# Altium schematic sheet Main_1.SchDoc
size 299 x 299 mm; SheetNumber: 4; SheetTotal: 12
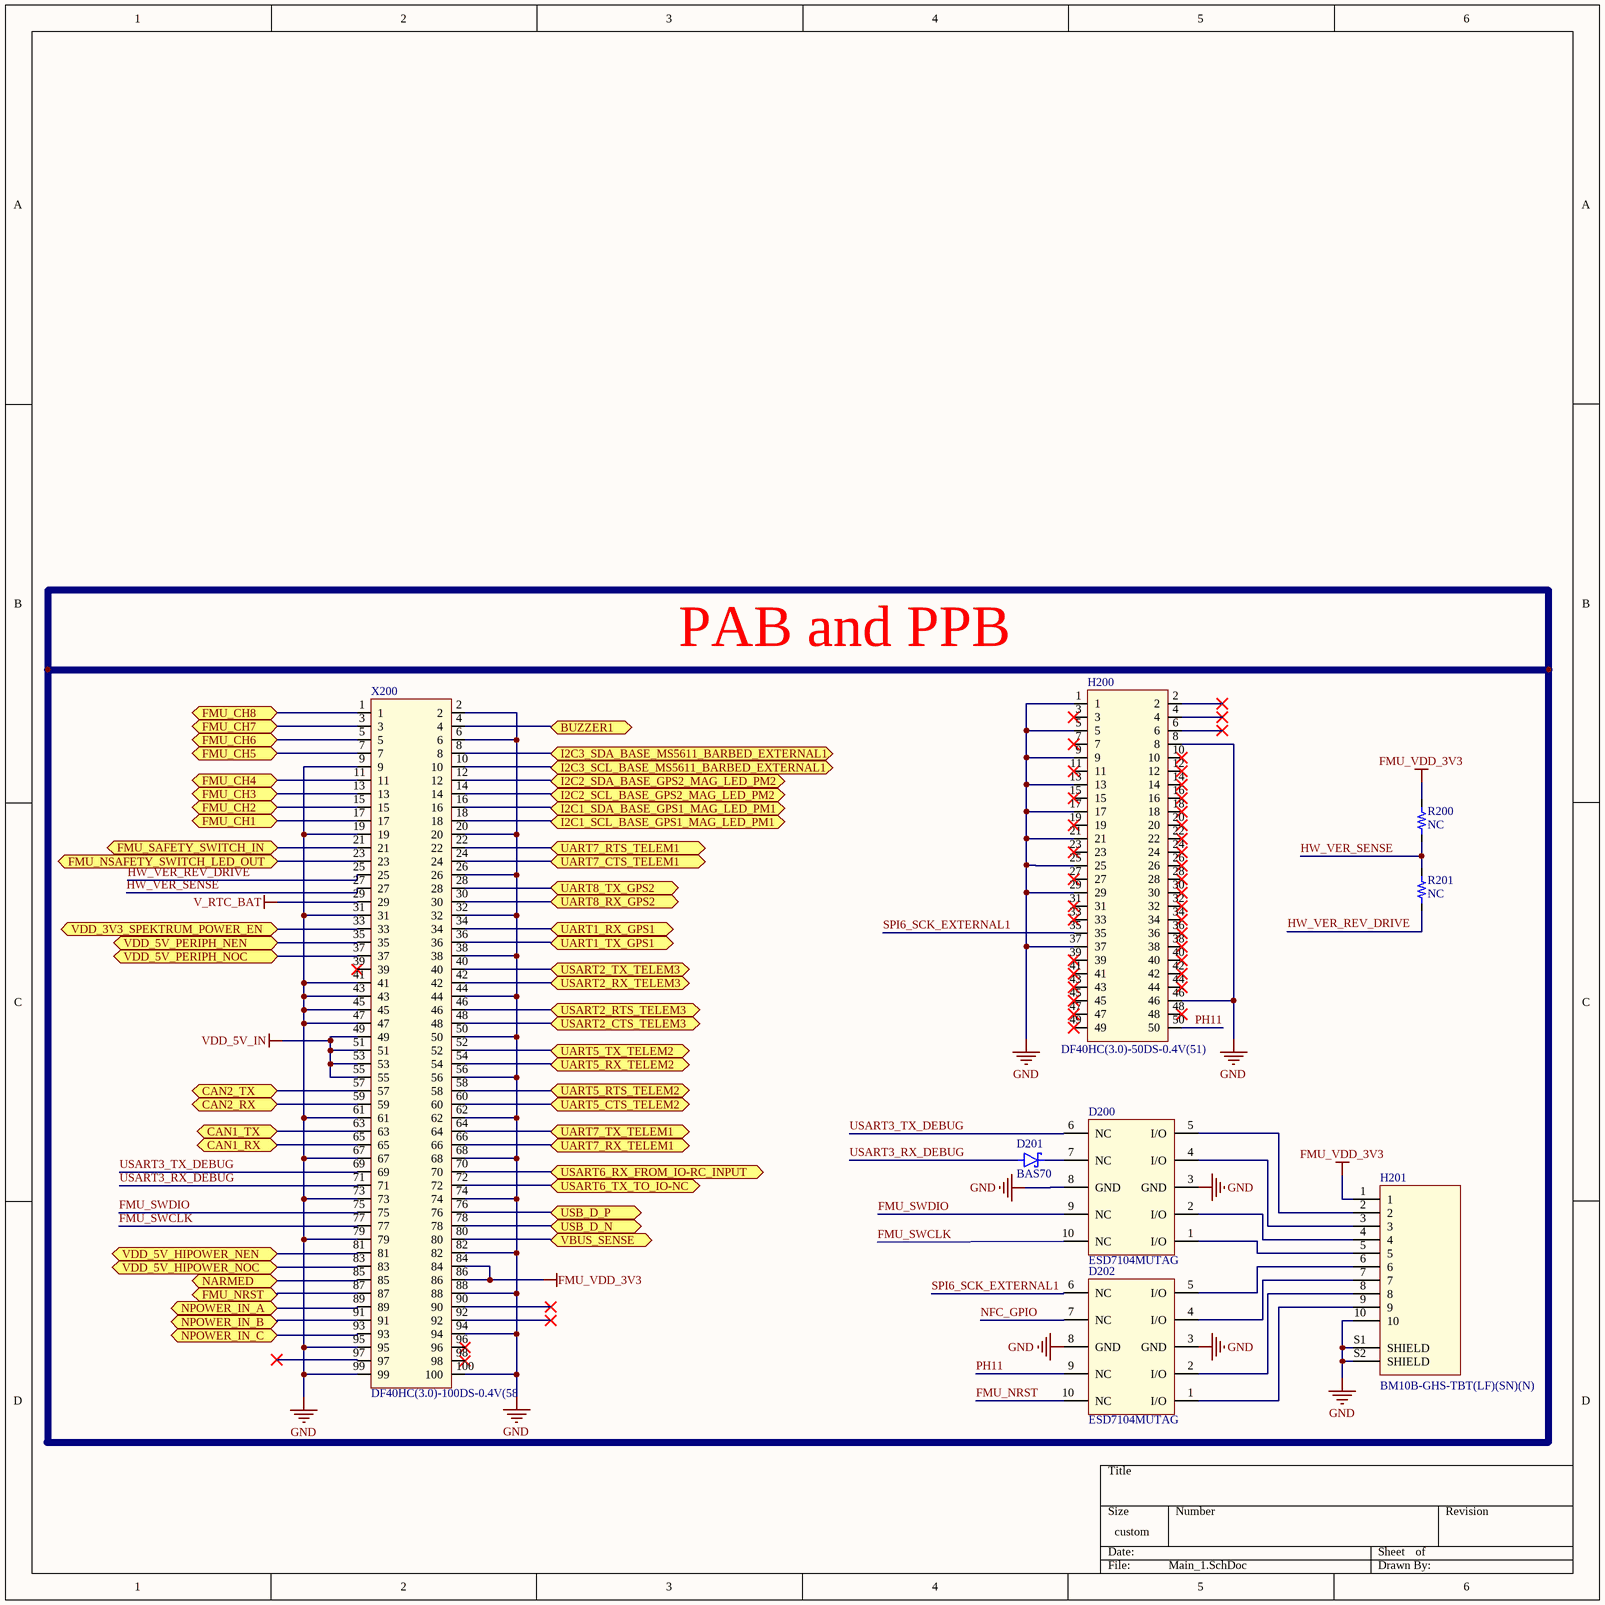
[diagram p0: Main_1.SchDoc]

## Parts
D200  ESD7104MUTAG  [UDFN10 2.5x1, 0.5P]
D201  BAS70  [SOT-23-3]
D202  ESD7104MUTAG  [UDFN10 2.5x1, 0.5P]
H200  DF40HC(3.0)-50DS-0.4V(51)  [DF40HC(4.0)-50DS-0.4V(51)]
H201  BM10B-GHS-TBT(LF)(SN)(N)  [BM10B-GHS-TBT(LF)(SN)(N)]
R200  NC  [R0603]
R201  NC  [R0603]
X200  DF40HC(3.0)-100DS-0.4V(58  [DF40HC(3.0)-100DS-0.4V(58]

## Ports
BUZZER1 (bidir), CAN1_RX (bidir), CAN1_TX (bidir), CAN2_RX (bidir), CAN2_TX (bidir), FMU_CH1 (bidir), FMU_CH2 (bidir), FMU_CH3 (bidir), FMU_CH4 (bidir), FMU_CH5 (bidir), FMU_CH6 (bidir), FMU_CH7 (bidir), FMU_CH8 (bidir), FMU_NRST (bidir), FMU_NSAFETY_SWITCH_LED_OUT (bidir), FMU_SAFETY_SWITCH_IN (bidir), I2C1_SCL_BASE_GPS1_MAG_LED_PM1 (bidir), I2C1_SDA_BASE_GPS1_MAG_LED_PM1 (bidir), I2C2_SCL_BASE_GPS2_MAG_LED_PM2 (bidir), I2C2_SDA_BASE_GPS2_MAG_LED_PM2 (bidir), I2C3_SCL_BASE_MS5611_BARBED_EXTERNAL1 (bidir), I2C3_SDA_BASE_MS5611_BARBED_EXTERNAL1 (bidir), NARMED (bidir), NPOWER_IN_A (bidir), NPOWER_IN_B (bidir), NPOWER_IN_C (bidir), UART1_RX_GPS1 (bidir), UART1_TX_GPS1 (bidir), UART5_CTS_TELEM2 (bidir), UART5_RTS_TELEM2 (bidir), UART5_RX_TELEM2 (bidir), UART5_TX_TELEM2 (bidir), UART7_CTS_TELEM1 (bidir), UART7_RTS_TELEM1 (bidir), UART7_RX_TELEM1 (bidir), UART7_TX_TELEM1 (bidir), UART8_RX_GPS2 (bidir), UART8_TX_GPS2 (bidir), USART2_CTS_TELEM3 (bidir), USART2_RTS_TELEM3 (bidir), USART2_RX_TELEM3 (bidir), USART2_TX_TELEM3 (bidir), USART6_RX_FROM_IO-RC_INPUT (bidir), USART6_TX_TO_IO-NC (bidir), USB_D_N (bidir), USB_D_P (bidir), VBUS_SENSE (bidir), VDD_3V3_SPEKTRUM_POWER_EN (bidir), VDD_5V_HIPOWER_NEN (bidir), VDD_5V_HIPOWER_NOC (bidir), VDD_5V_PERIPH_NEN (bidir), VDD_5V_PERIPH_NOC (bidir)

## Nets
FMU_VDD_3V3: H201.1 R200.2 X200.84 X200.86
GND: D200.3(GND) D200.8(GND) D202.3(GND) D202.8(GND) H200.1 H200.5 H200.8 H200.9 H200.13 H200.17 H200.21 H200.25 H200.29 H200.37 H200.46 H201.10 H201.S1(SHIELD) H201.S2(SHIELD) X200.2 X200.6 X200.9 X200.19 X200.20 X200.26 X200.31 X200.32 X200.38 X200.41 X200.43 X200.44 X200.45 X200.47 X200.50 X200.56 X200.61 X200.62 X200.67 X200.68 X200.73 X200.74 X200.79 X200.82 X200.88 X200.94 X200.95 X200.99 X200.100
V_RTC_BAT: X200.29
VDD_5V_IN: X200.49 X200.51 X200.53 X200.55
BUZZER1: X200.4 ; port BUZZER1
CAN1_RX: X200.65 ; port CAN1_RX
CAN1_TX: X200.63 ; port CAN1_TX
CAN2_RX: X200.59 ; port CAN2_RX
CAN2_TX: X200.57 ; port CAN2_TX
FMU_CH1: X200.17 ; port FMU_CH1
FMU_CH2: X200.15 ; port FMU_CH2
FMU_CH3: X200.13 ; port FMU_CH3
FMU_CH4: X200.11 ; port FMU_CH4
FMU_CH5: X200.7 ; port FMU_CH5
FMU_CH6: X200.5 ; port FMU_CH6
FMU_CH7: X200.3 ; port FMU_CH7
FMU_CH8: X200.1 ; port FMU_CH8
FMU_NRST: D202.10(NC)
FMU_NRST: X200.87 ; port FMU_NRST  [a separate net that carries the same name]
FMU_NSAFETY_SWITCH_LED_OUT: X200.23 ; port FMU_NSAFETY_SWITCH_LED_OUT
FMU_SAFETY_SWITCH_IN: X200.21 ; port FMU_SAFETY_SWITCH_IN
FMU_SWCLK: D200.10(NC) X200.77
FMU_SWDIO: D200.9(NC) X200.75
HW_VER_REV_DRIVE: R201.1 X200.25
HW_VER_SENSE: R200.1 R201.2 X200.27
I2C1_SCL_BASE_GPS1_MAG_LED_PM1: X200.18 ; port I2C1_SCL_BASE_GPS1_MAG_LED_PM1
I2C1_SDA_BASE_GPS1_MAG_LED_PM1: X200.16 ; port I2C1_SDA_BASE_GPS1_MAG_LED_PM1
I2C2_SCL_BASE_GPS2_MAG_LED_PM2: X200.14 ; port I2C2_SCL_BASE_GPS2_MAG_LED_PM2
I2C2_SDA_BASE_GPS2_MAG_LED_PM2: X200.12 ; port I2C2_SDA_BASE_GPS2_MAG_LED_PM2
I2C3_SCL_BASE_MS5611_BARBED_EXTERNAL1: X200.10 ; port I2C3_SCL_BASE_MS5611_BARBED_EXTERNAL1
I2C3_SDA_BASE_MS5611_BARBED_EXTERNAL1: X200.8 ; port I2C3_SDA_BASE_MS5611_BARBED_EXTERNAL1
NARMED: X200.85 ; port NARMED
NFC_GPIO: D202.7(NC)
NPOWER_IN_A: X200.89 ; port NPOWER_IN_A
NPOWER_IN_B: X200.91 ; port NPOWER_IN_B
NPOWER_IN_C: X200.93 ; port NPOWER_IN_C
PH11: D202.9(NC) H200.50
SPI6_SCK_EXTERNAL1: D202.6(NC) H200.35
UART1_RX_GPS1: X200.34 ; port UART1_RX_GPS1
UART1_TX_GPS1: X200.36 ; port UART1_TX_GPS1
UART5_CTS_TELEM2: X200.60 ; port UART5_CTS_TELEM2
UART5_RTS_TELEM2: X200.58 ; port UART5_RTS_TELEM2
UART5_RX_TELEM2: X200.54 ; port UART5_RX_TELEM2
UART5_TX_TELEM2: X200.52 ; port UART5_TX_TELEM2
UART7_CTS_TELEM1: X200.24 ; port UART7_CTS_TELEM1
UART7_RTS_TELEM1: X200.22 ; port UART7_RTS_TELEM1
UART7_RX_TELEM1: X200.66 ; port UART7_RX_TELEM1
UART7_TX_TELEM1: X200.64 ; port UART7_TX_TELEM1
UART8_RX_GPS2: X200.30 ; port UART8_RX_GPS2
UART8_TX_GPS2: X200.28 ; port UART8_TX_GPS2
USART2_CTS_TELEM3: X200.48 ; port USART2_CTS_TELEM3
USART2_RTS_TELEM3: X200.46 ; port USART2_RTS_TELEM3
USART2_RX_TELEM3: X200.42 ; port USART2_RX_TELEM3
USART2_TX_TELEM3: X200.40 ; port USART2_TX_TELEM3
USART3_RX_DEBUG: D201.1(A) X200.71
USART3_TX_DEBUG: D200.6(NC) X200.69
USART6_RX_FROM_IO-RC_INPUT: X200.70 ; port USART6_RX_FROM_IO-RC_INPUT
USART6_TX_TO_IO-NC: X200.72 ; port USART6_TX_TO_IO-NC
USB_D_N: X200.78 ; port USB_D_N
USB_D_P: X200.76 ; port USB_D_P
VBUS_SENSE: X200.80 ; port VBUS_SENSE
VDD_3V3_SPEKTRUM_POWER_EN: X200.33 ; port VDD_3V3_SPEKTRUM_POWER_EN
VDD_5V_HIPOWER_NEN: X200.81 ; port VDD_5V_HIPOWER_NEN
VDD_5V_HIPOWER_NOC: X200.83 ; port VDD_5V_HIPOWER_NOC
VDD_5V_PERIPH_NEN: X200.35 ; port VDD_5V_PERIPH_NEN
VDD_5V_PERIPH_NOC: X200.37 ; port VDD_5V_PERIPH_NOC
NetD200_1: D200.1(I/O) H201.5
NetD200_2: D200.2(I/O) H201.4
NetD200_4: D200.4(I/O) H201.3
NetD200_5: D200.5(I/O) H201.2
NetD200_7: D200.7(NC) D201.3(C)
NetD202_1: D202.1(I/O) H201.9
NetD202_2: D202.2(I/O) H201.8
NetD202_4: D202.4(I/O) H201.7
NetD202_5: D202.5(I/O) H201.6

Not connected (* = marked no-connect by the designer): H200 2* 3* 4* 6* 7* 10* 11* 12* 14* 15* 16* 18* 19* 20* 22* 23* 24* 26* 27* 28* 30* 31* 32* 33* 34* 36* 38* 39* 40* 41* 42* 43* 44* 45* 47* 48* 49*; X200 39* 90* 92* 96* 97* 98*

## Notes on the sheet
- PAB and PPB

## Library data of the parts
D200 D202 = ESD7104MUTAG: TVS DIODE 5VWM 10VC 10UDFN
D201 = BAS70-04-7-F: Schottky Diodes & Rectifiers 70V 200mW
H200 = DF40HC(3.0)-50DS-0.4V(51): CONN RCPT 50POS SMD GOLD
H201 = BM10B-GHS-TBT(LF)(SN)(N): Connector Header Surface Mount 10 position 0.049" (1.25mm)
R200 R201 = Resistor_NC
X200 = DF40HC(3.0)-100DS-0.4V(58: 100 Position Connector Receptacle, Center Strip Contacts Surface Mount Gold